# Altium schematic sheet NeoPixel.SchDoc: test
size A4; Engineer: Jayson Gorissen; Organization: PXL
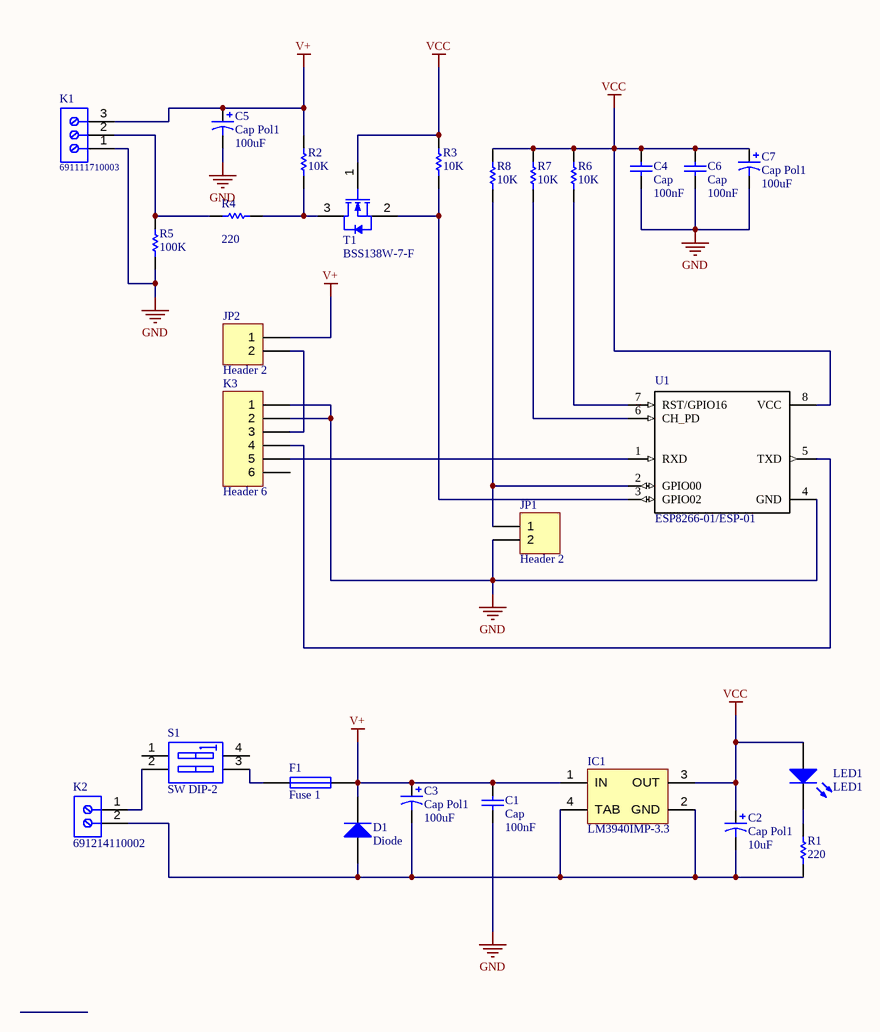
[diagram p0: NeoPixel.SchDoc]

## Parts
C1  Cap  value 100nF  [3.2X1.6X1.1]
C2  Cap Pol1  value 10uF  [RB7.6-15]
C3  Cap Pol1  value 100uF  [RB7.6-15]
C4  Cap  value 100nF  [3.2X1.6X1.1]
C5  Cap Pol1  value 100uF  [RB7.6-15]
C6  Cap  value 100nF  [3.2X1.6X1.1]
C7  Cap Pol1  value 100uF  [RB7.6-15]
D1  Diode  [SMC]
F1  Fuse 1  [PIN-W2/E2.8]
IC1  LM3940IMP-3.3  [DCY0004A_L]
JP1  Header 2  [HDR1X2]
JP2  Header 2  [HDR1X2]
K1  691111710003  [691111710003]
K2  691214110002  [691214110002]
K3  Header 6  [HDR1X6]
LED1  LED1  [LED-1]
R1  value 220  [3.2X1.6X1.1]  (hidden comment: Res1)
R2  value 10K  [3.2X1.6X1.1]  (hidden comment: Res1)
R3  value 10K  [3.2X1.6X1.1]  (hidden comment: Res1)
R4  value 220  [3.2X1.6X1.1]  (hidden comment: Res1)
R5  value 100K  [3.2X1.6X1.1]  (hidden comment: Res1)
R6  value 10K  [3.2X1.6X1.1]  (hidden comment: Res1)
R7  value 10K  [3.2X1.6X1.1]  (hidden comment: Res1)
R8  value 10K  [3.2X1.6X1.1]  (hidden comment: Res1)
S1  SW DIP-2  [DIP-4]
T1  BSS138W-7-F  [DIOD-SOT323-3_V]
U1  ESP8266-01/ESP-01  [*XCVR_ESP8266-01/ESP-01]

## Nets
GND: C1.1 C4.1 C5.2 C6.1 C7.2 JP1.2 K1.1 K3.1 K3.2 R5.1 U1.4(GND)
V+: C1.2 C3.1 C5.1 D1.2(K) F1.2 IC1.1(IN) JP2.1 K1.3 R2.2
VCC: C2.1 C4.2 C6.2 C7.1 IC1.3(OUT) LED1.1(A) R3.2 R6.2 R7.2 R8.2 T1.1(G) U1.8(VCC)
NetC2_2: C2.2 C3.2 D1.1(A) IC1.2(GND) IC1.4(TAB) K2.2 R1.1
NetF1_1: F1.1 S1.3(B2)
NetJP1_1: JP1.1 R8.1 U1.2(GPIO00)
NetJP2_2: JP2.2 K3.3
NetK1_2: K1.2 R4.1 R5.2
NetK2_1: K2.1 S1.2(A2)
NetK3_4: K3.4 U1.5(TXD)
NetK3_5: K3.5 U1.1(RXD)
NetLED1_2: LED1.2(K) R1.2
NetR2_1: R2.1 R4.2 T1.3(D)
NetR3_1: R3.1 T1.2(S) U1.3(GPIO02)
NetR6_1: R6.1 U1.7(RST/GPIO16)
NetR7_1: R7.1 U1.6(CH_PD)

Not connected (* = marked no-connect by the designer): K3 6; S1 1(A1) 4(B1)

## Library data of the parts
C1 C4 C6 = Cap: Capacitor; Published: 8-Jun-2000; LatestRevisionDate: 17-Jul-2002; LatestRevisionNote: Re-released for DXP Platform.; PackageReference: RAD-0.3; Publisher: Altium Limited; PackageDescription: Radial Cap, Thru-Hole; 2 Leads; 0.3 in Pin Spacing
C2 C3 C5 C7 = Cap Pol1: Polarized Capacitor (Radial); Published: 8-Jun-2000; LatestRevisionDate: 17-Jul-2002; LatestRevisionNote: Re-released for DXP Platform.; PackageReference: RB7.6-15; Publisher: Altium Limited; PackageDescription: Polarized Capacitor (Radial); 2 Leads
D1 = Diode: Default Diode; Published: 8-Jun-2000; LatestRevisionDate: 17-Jul-2002; LatestRevisionNote: Re-released for DXP Platform.; PackageVersion: Sep-1996; PackageReference: SMC; Publisher: Altium Limited; PackageDescription: DO-214-AB/SMC; 2 C-Bend Leads; Body 7.9 x 5.9 mm, inc. leads (LxW); Code_JEDEC: DO-214-AB
F1 = Fuse 1: Fuse; Published: 8-Jun-2000; LatestRevisionDate: 17-Jul-2002; LatestRevisionNote: Re-released for DXP Platform.; PackageReference: PIN-W2/E2.8; Publisher: Altium Limited; PackageDescription: Thru-Hole; 2 Leads
IC1 = CMP-0062-01793-3: 1A Low Dropout Regulator for 5V to 3.3V Conversion, 4-pin SOT-223; Manufacturer: Texas Instruments; PackageTopMarking: XYTT*L52B; CompType: LDO IC; PowerWise: N; Code_JEDEC: TO-261-AA; PackageDescription: Molded SOT-223, 6.50 x 3.56 x 1.6mm Body, 4 Lead, 2.3mm Pitch; PinCount: 4; ComponentLink1Description: Datasheet URL; PackageReference: DCY0004A; Code_IPC: SOT223-4; ComponentLink1URL: http://www.ti.com/general/docs/lit/getliterature.tsp?genericPartNumber=LM3940&fileType=pdf; RoHS: N
JP1 JP2 = Header 2: Header, 2-Pin; LatestRevisionDate: 17-Jul-2002; LatestRevisionNote: Re-released for DXP Platform.; Publisher: Altium Limited
K1 = CMP-1502-03263-1: Series 111 - 5.00 mm Horizontal Entry Modular with Pressure Clamp WR-TBL, 3 pin; Manufacturer: Wurth Elektronik; Pin Number: 3; Pitch: 5.00mm; Packaging: Box; Mounting Technology: THT; Part Number: 691111710003; Manufacturer URL: http://www.we-online.de; Publisher: WurthElektronik; Datasheet URL: http://katalog.we-online.de/em/datasheet/6911117100xx.pdf; Operating Temperature: -40to105degC; Package Reference: 691111710003
K2 = CMP-1502-02464-1: Serie 2141 - 3.50 mm Horizontal Entry Modular with Rising Cage Clamp WR-TBL, 2 pin; Manufacturer: Wurth Elektronik; Pin Number: 2; Pitch: 3.50mm; Datasheet URL: http://katalog.we-online.de/em/datasheet/6912141100xx.pdf; Packaging: Box; Mounting Technology: THT; Package Reference: 691214110002; Manufacturer URL: http://www.we-online.de; Part Number: 691214110002; Publisher: WurthElektronik; Operating Temperature: -40to105degC
K3 = Header 6: Header, 6-Pin; LatestRevisionDate: 17-Jul-2002; LatestRevisionNote: Re-released for DXP Platform.; Publisher: Altium Limited
LED1 = LED1: Typical RED GaAs LED; Published: 8-Jun-2000; LatestRevisionDate: 08-Jul-2005; LatestRevisionNote: Mech Layer 1 removed.; PackageReference: LED-1; Publisher: Altium Limited; PackageDescription: LED; 2 Leads
R1-R8 = Res1: Resistor; Published: 8-Jun-2000; LatestRevisionDate: 17-Jul-2002; LatestRevisionNote: Re-released for DXP Platform.; PackageReference: AXIAL-0.3; Publisher: Altium Limited; PackageDescription: Axial Device, Thru-Hole; 2 Leads; 0.3 in Pin Spacing
S1 = SW DIP-2: DIP Switch, 2 Position, SPST; Published: 24-Mar-1999; LatestRevisionDate: 17-Jul-2002; LatestRevisionNote: Re-released for DXP Platform.; PackageReference: DIP-4; Publisher: Altium Limited
T1 = CMP-2000-05968-1: N-Channel Enhancement Mode Mosfet, 50 V, 200 mA, -55 to 150 degC, 6-Pin SOT-323, RoHS, Tape and Reel; Typical Turn-Off Delay Time: 20ns; Number of Channels: 1Channel; Type: EnhancementModeFieldEffectTransistor; Brand: DiodesIncorporated; Vds - Drain-Source Breakdown Voltage: 75V; Vgs - Gate-Source Voltage: 20V; Rds On - Drain-Source Resistance: 1.4Ohms; Transistor Type: 1N-Channel; Configuration: Single; Unit Weight: 0.000212oz; Pd - Power Dissipation: 200mW; Id - Continuous Drain Current: 200mA; Forward Transconductance - Min: 0.1S; Manufacturer URL: http://www.diodes.com/; Series: BSS138; Package Description: 3-Pin Small Outline Transistor, Body 2 x 1.25 mm, Pitch 0.65 mm; Mounting Technology: SurfaceMount; Product Category: MOSFET; RoHS: True; Maximum Operating Temperature: +150C; Height: 1mm; Length: 2.2mm; Technology: Si; Width: 1.35mm; Datasheet URL: http://www.diodes.com/_files/datasheets/ds30206.pdf; Manufacturer: DiodesIncorporated; Package / Case: SOT-323-3; Typical Turn-On Delay Time: 20ns; Transistor Polarity: N-Channel; Factory Pack Quantity: 3000; Packaging: Reel; Product: MOSFETSmallSignal; Datasheet Version: Rev. 11-2, 09/2013; Package Reference: SOT323; Minimum Operating Temperature: -55C; Mounting Style: SMD/SMT; Channel Mode: Enhancement
U1 = ESP8266-01/ESP-01: SnapEDA_Link: https://www.snapeda.com/parts/ESP8266-01/ESP-01/AI-Thinker/view-part/106413/?ref=snap; Value: *